# Altium schematic sheet 3_USB_TO_UART.SchDoc: USB_TO_UART
size A4; ApprovedBy: Alcatraz; CheckedBy: Alcatraz; Author: Alcatraz; CompanyName: DHNLAB; DrawnBy: Alcatraz; Engineer: Alcatraz; Organization: DHNLAB PVT LTD; Address1: DHANBAD; Address2: JHARKHAND; Address3: INDIA; Address4: ASIA; DocumentNumber: 3; Revision: 1.0; SheetNumber: 3; SheetTotal: 7; ProjectTitle: USB-UART-ISO-CP2102
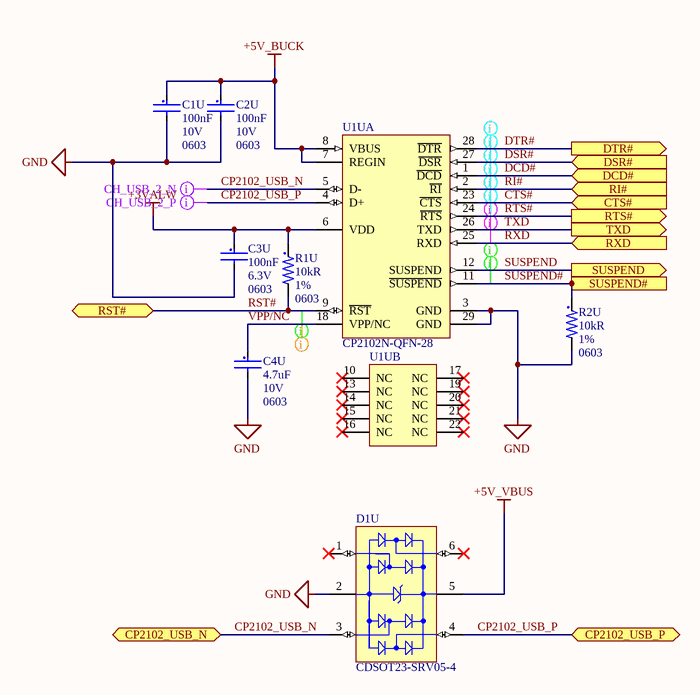
[diagram p0: 3_USB_TO_UART.SchDoc]

## Parts
C1U  value 100nF  Voltage Rating (DC): 10V  Case/Package: 0603  [C0603-IPC_C_No_Silk]  (hidden comment: C0603C104K8RACTU)
C2U  value 100nF  Voltage Rating (DC): 10V  Case/Package: 0603  [C0603-IPC_C_No_Silk]  (hidden comment: C0603C104K8RACTU)
C3U  value 100nF  Voltage: 6.3V  Package: 0603  [C0603-IPC_C_No_Silk]  (hidden comment: KGM15AR70J104KM)
C4U  value 4.7uF  Voltage Rating (DC): 10V  Case/Package: 0603  [C0603-IPC_C_No_Silk]  (hidden comment: CL10A475KP8NNNC)
D1U  CDSOT23-SRV05-4  [SOT23-6-IPC_C]
R1U  value 10kR  Tolerance: 1%  Case/Package: 0603  [R0603-MFG]  (hidden comment: RC0603FR-0710KL)
R2U  value 10kR  Tolerance: 1%  Case/Package: 0603  [R0603-MFG]  (hidden comment: RC0603FR-0710KL)
U1U  CP2102N-QFN-28  [QFN28_IPC_A]  (parts A,B of 2)

## Ports
CP2102_USB_N (bidir), CP2102_USB_P (bidir), CTS# (in), DCD# (in), DSR# (in), DTR# (out), RI# (in), RST# (bidir), RTS# (out), RXD (in), SUSPEND (out), SUSPEND# (out), TXD (out)

## Nets
+3VALW: C3U.1 R1U.1 U1U.6(VDD)
+5V_BUCK: C1U.1 C2U.1 U1U.7(REGIN) U1U.8(VBUS)
+5V_VBUS: D1U.5(VBUS)
GND: C1U.2 C2U.2 C3U.2 C4U.2 D1U.2(GND) R2U.2 U1U.3(GND) U1U.29(GND)
CP2102_USB_N: D1U.3(I/O_2) U1U.5(D-) ; port CP2102_USB_N
CP2102_USB_P: D1U.4(I/O_3) U1U.4(D+) ; port CP2102_USB_P
CTS#: U1U.23(~{CTS}) ; port CTS#
DCD#: U1U.1(~{DCD}) ; port DCD#
DSR#: U1U.27(~{DSR}) ; port DSR#
DTR#: U1U.28(~{DTR}) ; port DTR#
RI#: U1U.2(~{RI}) ; port RI#
RST#: R1U.2 U1U.9(~{RST}) ; port RST#
RTS#: U1U.24(~{RTS}) ; port RTS#
RXD: U1U.25(RXD) ; port RXD
SUSPEND: U1U.12(SUSPEND) ; port SUSPEND
SUSPEND#: R2U.1 U1U.11(~{SUSPEND}) ; port SUSPEND#
TXD: U1U.26(TXD) ; port TXD
VPP/NC: C4U.1 U1U.18(VPP/NC)

Not connected (* = marked no-connect by the designer): D1U 1(I/O_1)* 6(I/O_4)*; U1U 10(NC)* 13(NC)* 14(NC)* 15(NC)* 16(NC)* 17(NC)* 19(NC)* 20(NC)* 21(NC)* 22(NC)*

## Layout directives
net class Signal; net class Digital_Signal_Low_Speed; net class Digital_Signal_RS232: CTS#, DCD#, DSR#, DTR#, RI#, RTS#
net class Signal_50_ohm; net class Digital_Signal_Low_Speed; net class Digital_Signal_RS232: RXD, TXD
differential pair; differential pair class USB_DATA: CP2102_USB_N, CP2102_USB_P
net class Power; net class PowerRails_LowVoltage_DC; net class Power_Signal: VPP/NC
net class Digital_Signal_Low_Speed; net class Signal: RST#, SUSPEND, SUSPEND#

## Notes on the sheet
- Title:
- Author:
- Approved:
- Size:
- Date:
- Git Hash:
- A4
- Prj:
- SW Version:
- Variant:
- Edited:
- PUBLIC
- File:

## Library data of the parts
C1U C2U = 100nF_10V: Multilayer Ceramic Capacitor, 0.1 uF, 10 V, ± 10%, X7R, 0603 [1608 Metric]; Manufacturer: KEMET; Material: 4241ConductorMaterial; Dissipation Factor: 5%; Temperature Coefficient: 30ppm/°C; Supplier 1: Mouser; Supplier Part Number 1: 80-C0603C104K8R; Manufacturer Part Number: C0603C104K8RACTU; RoHS: Yes; Category: Ceramic Capacitors; Stock 1: 246409; Pricing 1: 1=0.11, 10=0.075, 50=0.075, 100=0.036, 1000=0.021, 10000=0.017 (USD); Mounting Technology: Surface Mount,PCB; Pins: 2; Case Code (Metric): 1608; Case Code (Imperial): 0603; Min Operating Temperature: -55°C; Max Operating Temperature: 125°C; Tolerance: 10%; Packaging: Tape and Reel; Voltage Rating: 10V; Series: C; Dielectric: X7R; Package Quantity: 1; Termination: SMD/SMT; Length: 1.6mm; Width: 0.031inch; Height: 0.8mm; Depth: 0.8mm; Thickness: 0.034inch; Radiation Hardening: No; RoHS Compliant: Yes; ComponentLink1URL: https://datasheet.ciiva.com/6093/1776114-6093269.pdf?src-supplier=Farnell; ComponentLink1Description: https://datasheet.ciiva.com/6093/1776114-6093269.pdf?src-supplier=Farnell; Dielectric Material: Ceramic; Lead Pitch: 0.7mm; Voltage: 10V; Construction: Flat; Reach SVHC Compliant: No; Lead Free: 5697LeadFree; ComponentLink2URL: https://datasheet.ciiva.com/7823/kem-c1002-x7r-smd-7823989.pdf?src-supplier=Element14; ComponentLink2Description: https://datasheet.ciiva.com/7823/kem-c1002-x7r-smd-7823989.pdf?src-supplier=Element14; ComponentLink3URL: https://datasheet.ciiva.com/22693/1851736-22693967.pdf?src-supplier=Element14; ComponentLink3Description: https://datasheet.ciiva.com/22693/1851736-22693967.pdf?src-supplier=Element14; ComponentLink4URL: https://datasheet.ciiva.com/14589/70095383-14589402.pdf?src-supplier=Allied+Electronics; ComponentLink4Description: https://datasheet.ciiva.com/14589/70095383-14589402.pdf?src-supplier=Allied+Electronics; ComponentLink5URL: https://datasheet.ciiva.com/14593/70095383-14593978.pdf?src-supplier=Allied+Electronics; ComponentLink5Description: https://datasheet.ciiva.com/14593/70095383-14593978.pdf?src-supplier=Allied+Electronics; ComponentLink6URL: https://datasheet.ciiva.com/5419/kem-c1002-x7r-smd-357932-5419657.pdf?src-supplier=Mouser; ComponentLink6Description: https://datasheet.ciiva.com/5419/kem-c1002-x7r-smd-357932-5419657.pdf?src-supplier=Mouser; ComponentLink7URL: https://datasheet.ciiva.com/18192/getdatasheetpartid-91529-18192711.pdf?src-supplier=Verical; ComponentLink7Description: https://datasheet.ciiva.com/18192/getdatasheetpartid-91529-18192711.pdf?src-supplier=Verical
C3U = 100nF_6.3V: Cap Cer 0.1UF 6.3V X7R 0603; Manufacturer: KYOCERA AVX; Tol: 10%; Supplier 1: Digikey; Supplier Part Number 1: 478-KGM15AR70J104KMCT-ND; Manufacturer Part Number: KGM15AR70J104KM; Category: Ceramic Capacitors; Stock 1: 117167; Pricing 1: 1=0.1, 10=0.032, 50=0.0186, 100=0.0144, 500=0.01082, 1000=0.0085, 2500=0.00772, 5000=0.00711 (USD)
C4U = 4.7uF_10V: Multilayer Ceramic Capacitor, 4.7 uF, 10 V, ± 10%, X5R, 0603 [1608 Metric]; Manufacturer: Samsung; Supplier 1: Verical; Supplier Part Number 1: CL10A475KP8NNNC; Manufacturer Part Number: CL10A475KP8NNNC; RoHS: Yes; Category: Ceramic Capacitors; Stock 1: 412000; Pricing 1: 4000=0.0042 (USD); Mounting Technology: Surface Mount; Case Code (Metric): 1608; Case Code (Imperial): 0603; Min Operating Temperature: -55°C; Max Operating Temperature: 85°C; Tolerance: 10%; Packaging: Tape and Reel; Voltage Rating: 10V; Series: CL; Dielectric: X5R; Package Quantity: 1; Length: 1.6mm; Width: 0.031inch; Height: 0.8mm; Depth: 0.8mm; Thickness: 0.035inch; Radiation Hardening: No; RoHS Compliant: Yes; Construction: Flat
D1U = SRV05-4: TVS DIODE 5V 15V SOT23-6; Manufacturer: Bourns Inc.; Direction: Bidirectional; Number Of Channels: 4; Breakdown Voltage: 6V; Peak Pulse Current: 30A; Standoff Height: 0.2mm; Peak Pulse Power: 500W; Max Junction Temp: +150°C; Manufacturer Part Number: CDSOT23-SRV05-4; RoHS: TRUE; Category: Diode; Clamping Voltage: 15V; Reverse Standoff Voltage: 5V; Height: 1.45mm; Lead Free: Yes; ComponentLink2URL: https://www.bourns.com/docs/Product-Datasheets/CDSOT23-SRV05-4.pdf; ComponentLink2Description: Datasheet; Temperature Range High: +150°C; Octopart: https://octopart.com/cdsot23-srv05-4-bourns-1679449; Automotive: No; Device Class L1: Circuit Protection; Temperature: -55°C to +150°C; Device Class L2: TVS Diodes; Temperature Range Low: -55°C; Device Class L3: unset; Package: CDSOT23-SRV05-4; Ipc Land Pattern Name: SOT95P280X118-6; Mouser Description: CDSOT23-SRV05-4, Quad Uni-Directional TVS Diode, 500W, 6-Pin SOT-23; Digikey Description: TVS DIODE 5V 15V SOT23-6
R1U R2U = 10K: SMD Chip Resistor, 10 kOhm, ± 1%, 100 mW, 0603 [1608 Metric], Thick Film, General Purpose; Manufacturer: Yageo; Power Rating: 100mW; Temperature Coefficient: 100ppm/°C; Voltage Rating: 75V; Voltage Rating (DC): 50V; Supplier 1: Future Electronics; Manufacturer Part Number: RC0603FR-0710KL; RoHS: Yes; Category: Chip SMD Resistors; Stock 1: 44660000; Pricing 1: 5000=0.0015, 50000=0.0014, 150000=0.0014, 375000=0.0013, 1000000=0.0012 (USD); Case Code (Imperial): 0603; Case Code (Metric): 1608; Min Operating Temperature: -55°C; Max Operating Temperature: 155°C; Packaging: Tape and Reel; Series: RC; Termination: SMD/SMT; Construction: Rectangular; Length: 1.6mm; Depth: 0.8mm; RoHS Compliant: Yes; Military Standard: Not; Lead Free: 5697LeadFree; Supplier Part Number 1: 4023214; Max Power Dissipation: 100mW; Features: Moisture Resistant; Number of Terminations: 2; Pins: 2; Weight: 7.1E-05oz; Resistance Tolerance: 1%; Resistor Type: Thick Film; Width: 0.8mm; Height: 0.45mm; Lead Pitch: 0.3mm; Reach SVHC Compliant: No
U1U = CP2102N-QFN-28: Single-Chip USB to UART Bridge, 1024 Bytes EEPROM, -40 to 85 degC, 28-pin QFN, Tube; Manufacturer: Silicon Labs; PartNumber: CP2102-GM; Internal Oscillator: TRUE; Sub-Family: USB Bridges; ComponentLink3Description: Package Specification; PackageDescription: 28-Pin Quad-Flat No-Leads Package, Body 5 x 5 mm, Pitch 0.5 mm; EEPROM: 1024 Bytes; Mounting Technology: Surface Mount; ComponentLink2URL: http://www.silabs.com/Support%20Documents/TechnicalDocs/CP2102-9.pdf; DatasheetVersion: Rev. 1.5; ComponentLink1URL: http://www.silabs.com/; ComponentLink2Description: Datasheet; Code_JEDEC: MO-220; PackageReference: QFN-28; Code_IPC: J-STD-020C; ComponentLink3URL: http://www.silabs.com/Support%20Documents/TechnicalDocs/C8051T61x.pdf; ComponentLink1Description: Manufacturer URL